# EAGLE design Grove - Voltage Divider v1.0 (EAGLE 6.3)
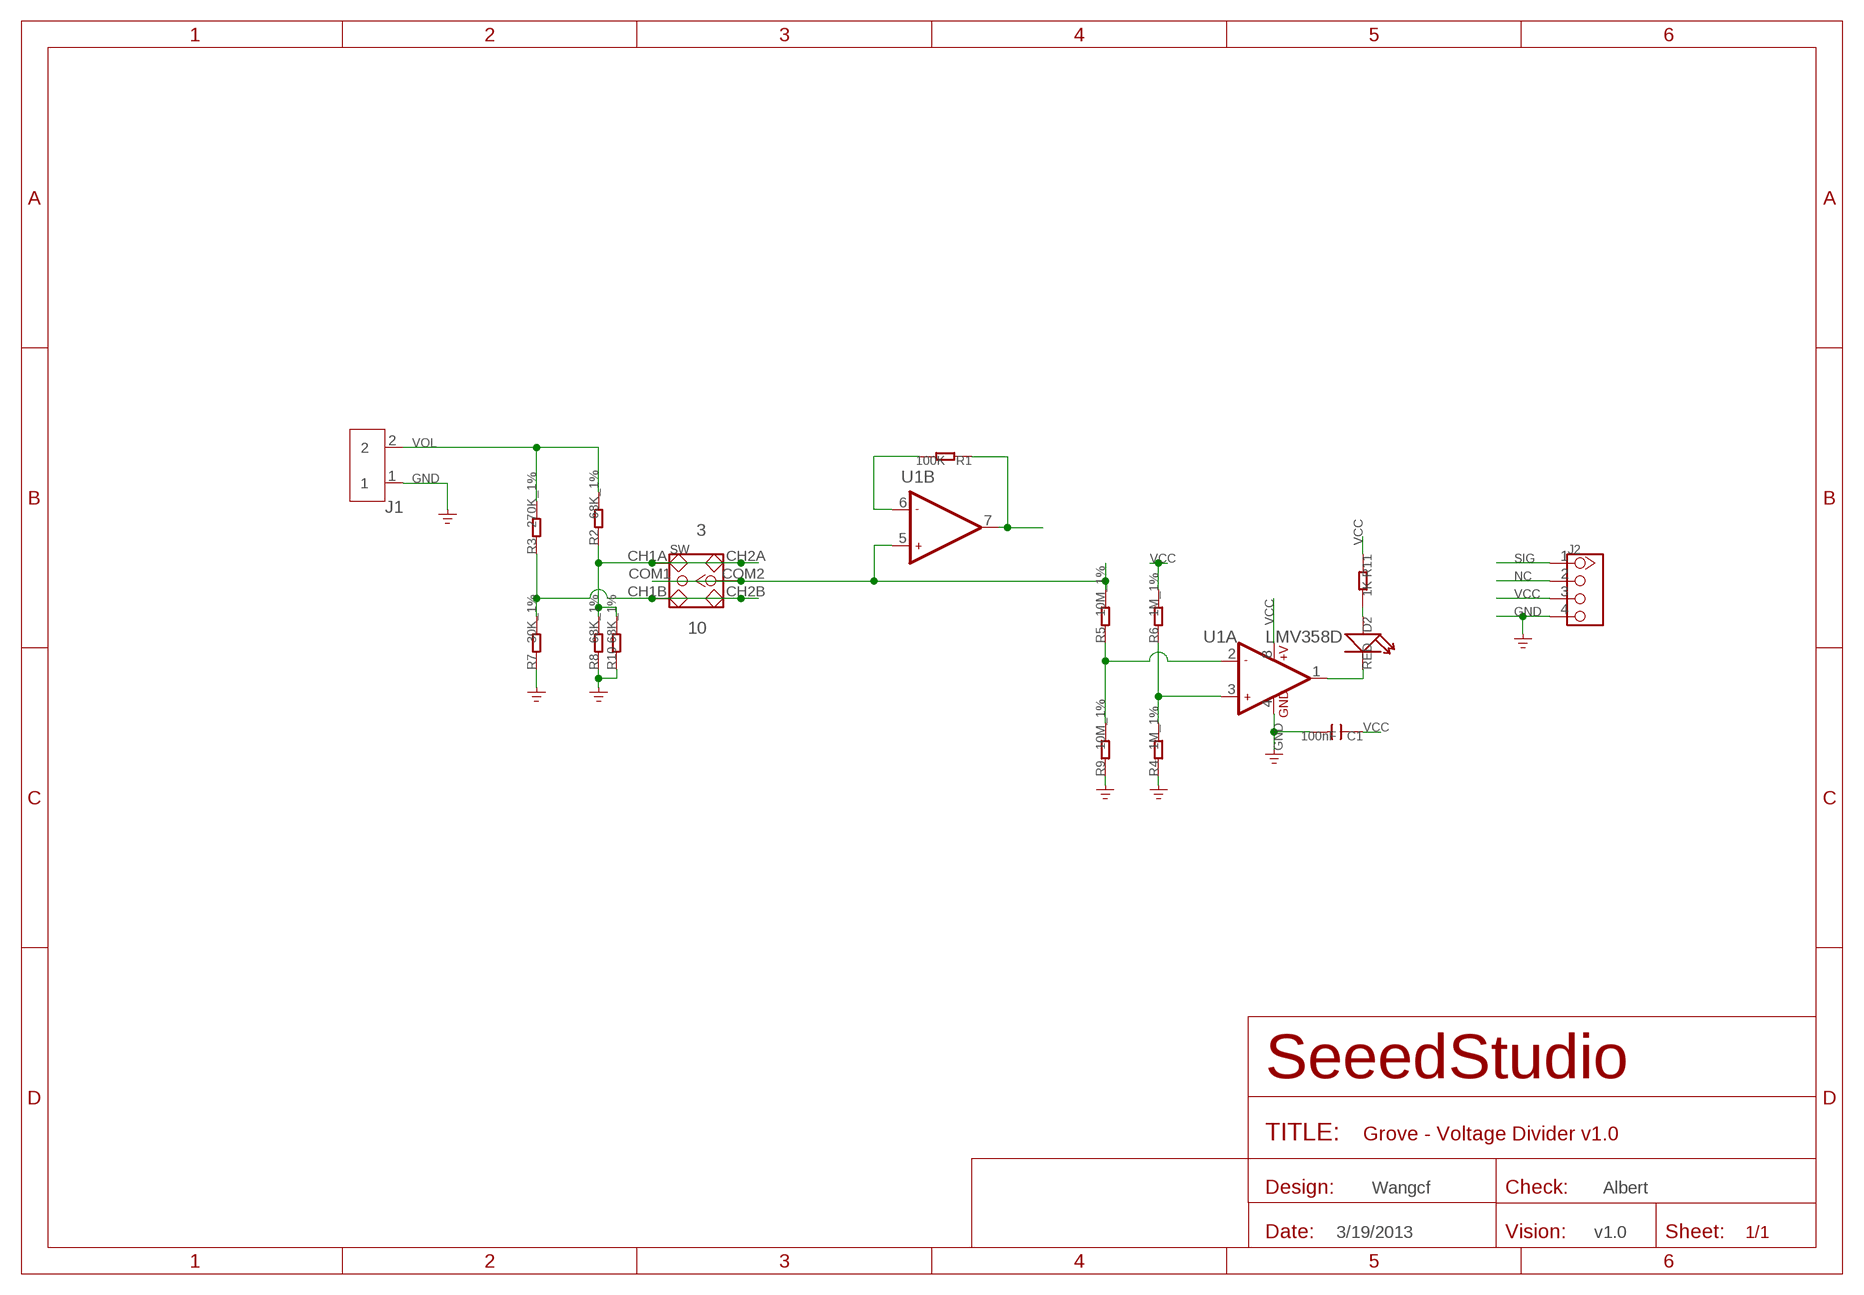
[diagram p0: schematic, sheet 1]

## Parts
C1  100nF  C-0603  [C0603]
D2  RED  LED'0603'  [LED-0603]
J1  SCREW-TERMINAL-2P'5.08'  [2P-5.08]
J2  TWIG-4P-2.0-2.0  [4P-2.0]
R1  100K  R-0603  [R0603]
R2  68K_1%  R-0603  [R0603]
R3  270K_1%  R-0603  [R0603]
R4  1M_1%  R-0603  [R0603]
R5  10M_1%  R-0603  [R0603]
R6  1M_1%  R-0603  [R0603]
R7  30K_1%  R-0603  [R0603]
R8  68K_1%  R-0603  [R0603]
R9  10M_1%  R-0603  [R0603]
R10  68K_1%  R-0603  [R0603]
R11  1K  R-0603  [R0603]
SW  SWITCH-2CH-6P'MS-22D18'  [6P-2CH-2.5-9.1X3.5X3.2H]
U1  LMV358D  [SO08]

## Nets
GND: C1.2 J1.1 J2.4 R4.1 R7.1 R8.1 R9.1 R10.1 U1.4(A:GND)
N$1: D2.+ R11.2
N$2: D2.- U1.1(A:OUT1)
N$5: R5.1 R9.2 U1.2(A:-IN1)
N$6: R5.2 SW.COM1 SW.COM2 U1.5(B:+IN2)
N$7: R4.2 R6.1 U1.3(A:+IN1)
N$8: R1.2 U1.6(B:-IN2)
NC: J2.2
SIG: J2.1 R1.1 U1.7(B:OUT2)
VCC: C1.1 J2.3 R6.2 R11.1 U1.8(A:+V)
VOL: J1.2 R2.2 R3.2
VOL1: R3.1 R7.2 SW.CH1B SW.CH2B
VOL2: R2.1 R8.2 R10.2 SW.CH1A SW.CH2A

## Notes on the sheet
- 3
- 10
- Wangcf | Albert
- 3/19/2013 | v1.0

## Library data of the parts
C1 = Discrete:C*: Ceramic Capacitors
D2 = Discrete:LED*
J1 = Connector:SCREW-TERMINAL-2P
J2 = Connector:TWIG-4P-2.0
R1-R11 = Discrete:R*
SW = Discrete:SWITCH-2CH-6P
U1 = IC:LMV358: General purpose LOW Voltage, Rail-to-Rail Output Amplifiers http://www.fairchildsemi.com/ds/LM/LMV358.pdf

## Net classes
0 default: width 0.203 mm, drill 0.305 mm, clearance 0.152 mm

## Board
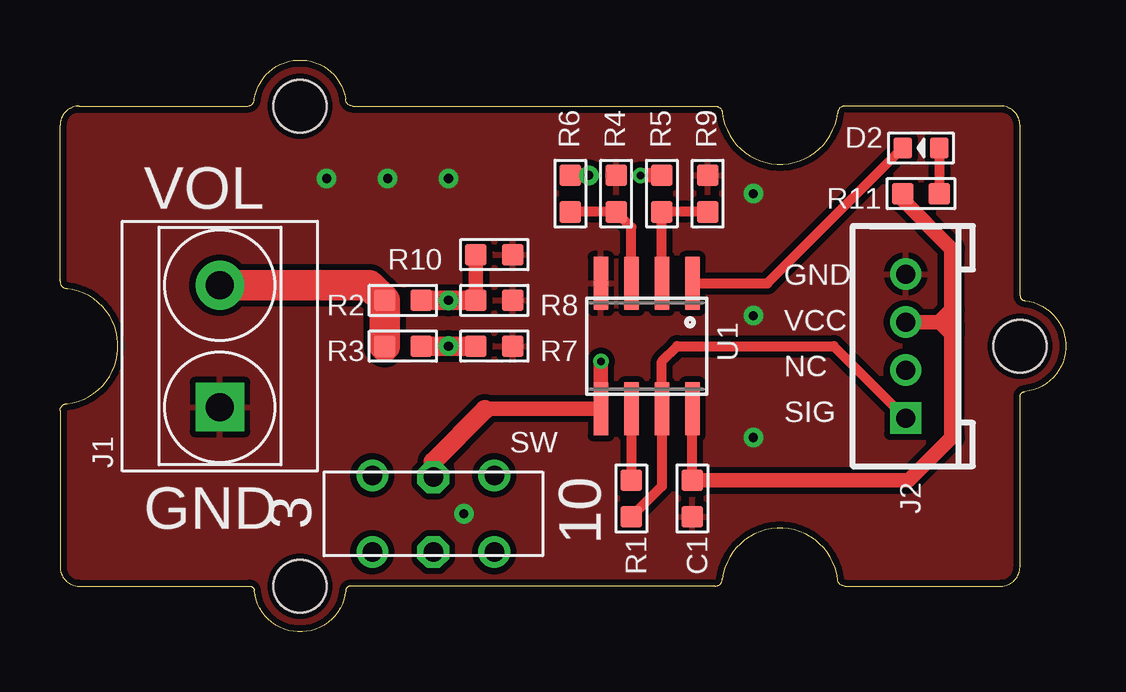
[diagram p1: board, top side]
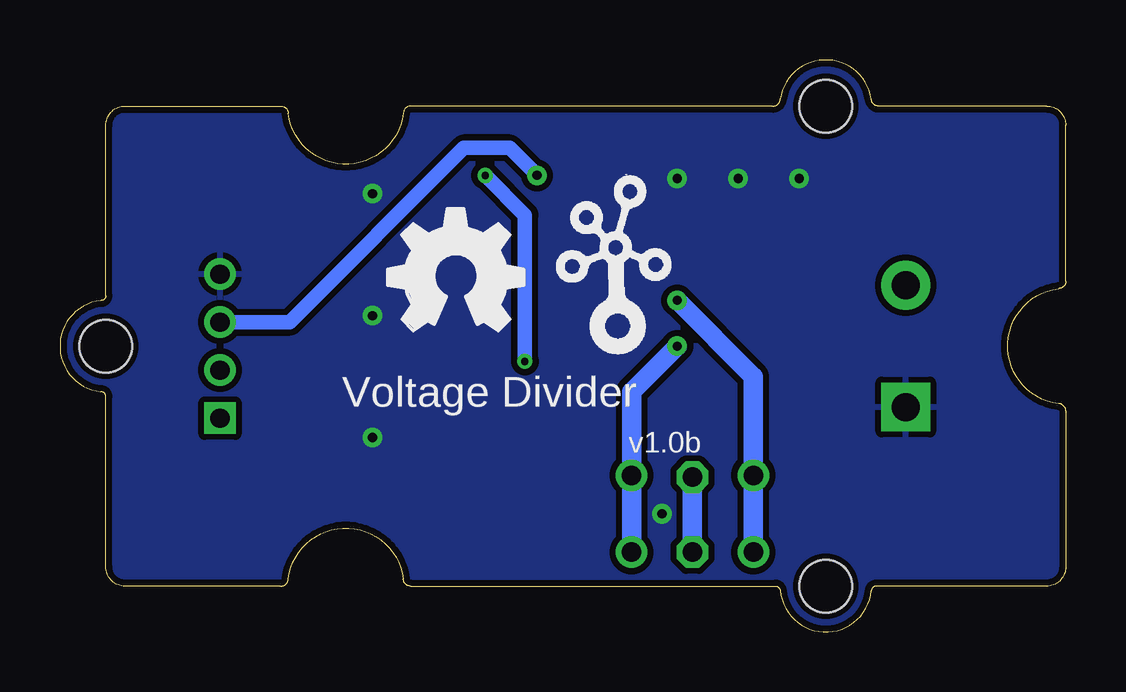
[diagram p2: board, bottom side, seen from below]

Size 41.91 x 23.83 mm. Coordinates in mm from the lower left corner, seen from the top.
Copper layers (1*16): Top 0.035mm / dielectric 1.5mm / Bottom 0.035mm
Design rules "SeeedStudio_rule_no_angle_090911 *": minimum track width 6mil, minimum drill 12mil, track to track 6mil, track to pad 6mil, pad to pad 6mil, via to via 6mil, smd to smd 0mil, copper to edge 10mil, drill to drill 10mil, minimum pad ring 10mil, minimum via ring 6mil, stop-mask expansion 2mil, vias tented up to drill 25mil, thermal gap 10mil

### Footprints (pad centres in the part's own frame; a part is rotated, then mirrored left to right if it is on the bottom)
C0603 = smd 0.889 x 0.889: 1 -0.762,0; 2 0.762,0
LED-0603 = smd 0.762 x 0.889: + -0.762,0; - 0.762,0
2P-5.08 = drill 1.168 pad 2.032 square: 1 0,2.54 | drill 1.168 pad 2.032: 2 0,-2.54
4P-2.0 = drill 0.8 pad 1.27 square: 1 -3,0 | drill 0.8 pad 1.27: 2 -1,0; 3 1,0; 4 3,0
R0603 = smd 0.889 x 0.889: 1 -0.762,0; 2 0.762,0
6P-2CH-2.5-9.1X3.5X3.2H = drill 0.813 pad 1.27: CH1A -2.54,-1.6; CH1B 2.54,-1.6; CH2A -2.54,1.6; CH2B 2.54,1.6 | drill 0.813 pad 1.27 octagon: COM1 0,-1.6; COM2 0,1.524
SO08 = smd 0.61 x 2.21: 1 -1.905,-2.616; 2 -0.635,-2.616; 3 0.635,-2.616; 4 1.905,-2.616; 5 1.905,2.616; 6 0.635,2.616; 7 -0.635,2.616; 8 -1.905,2.616
2U-DIM-W/DRILL = hole 2.2: -10,-10; -10,10; 20,0

### Placement (x,y rotation side)
C1  26.35,5.56 270 top
D2  35.88,20.16 180 top
J1  6.66,11.91 180 top
J2  35.24,11.91 90 top
R1  23.81,5.56 90 top
R2  14.29,13.81 180 top
R3  14.29,11.91 180 top
R4  23.18,18.26 270 top
R5  25.08,18.26 90 top
R6  21.27,18.26 90 top
R7  18.09,11.91 180 top
R8  18.09,13.81 180 top
R9  26.98,18.26 270 top
R10  18.09,15.72 180 top
R11  35.88,18.26 0 top
SW  15.55,4.92 0 top
U1  24.45,11.91 180 top
U$6  [2U-DIM-W/DRILL]  20,11.91 0 top
U$7  [OSHW_FILLX200_NOTEXT]  28.26,12.54 0 bottom
U$8  [TWIGLOGO]  18.73,12.54 0 bottom

### Tracks (layer width: path | path; a pad name or v marks a point on that pad's centre or on a via)
GND  (via drill 0.38 pad 0.81)
  other vias: 28.89,8.1 28.89,18.26 28.89,13.18 16.19,18.89 11.11,18.89 13.65,18.89 16.82,4.92
  pour Top (isolate 0.254): 42.23,23.97 -0.32,23.97 -0.32,-0.16 42.23,-0.16
  pour Bottom (isolate 0.254): 42.23,23.97 -0.32,23.97 -0.32,-0.16 42.23,-0.16
N$1
  Top 0.406: D2.+ R11.2
N$2
  Top 0.406: U1.1 29.47,14.52 D2.-
N$5
  Top 0.406: R9.2 R5.1 U1.2
N$6  (via drill 0.3 pad 0.64)
  Top 0.61: 17.71,9.25 17.75,9.29 U1.5 v22.54,11.27 | v24.19,19.02 R5.2
  Top 0.813: SW.COM2 15.55,7.1 17.71,9.25
  Bottom 0.61: v22.54,11.27 22.54,17.37 v24.19,19.02
  Bottom 0.813: SW.COM1 SW.COM2
N$7
  Top 0.406: U1.3 23.81,16.86 R4.2 R6.1
N$8
  Top 0.406: U1.6 R1.2
SIG
  Top 0.406: R1.1 25.08,6.07 U1.7 25.08,11.27 25.71,11.91 32.24,11.91 J2.1
VCC  (via drill 0.38 pad 0.81)
  Top 0.406: C1.1 U1.8
  Top 0.61: C1.1 35.37,6.32 37.14,8.1 37.14,12.42 | 37.14,12.8 37.14,13.43 | 37.14,13.43 37.14,15.97 35.11,18 R11.1 | J2.3 36.62,12.91 | 36.65,12.91 37.03,12.91 37.14,12.8 | R6.2 v22.03,19.02 | 36.62,12.91 37.14,13.43 | 36.62,12.91 36.65,12.91 | 36.65,12.91 37.14,12.42 | 37.14,12.42 37.14,12.8
  Bottom 0.61: v22.03,19.02 23.18,20.16 25.08,20.16 32.34,12.91 J2.3
VOL
  Top 1.27: R3.2 R2.2 12.89,14.45 J1.2
VOL1  (via drill 0.38 pad 0.81)
  Top 0.813: R7.2 v16.19,11.91 R3.1
  Bottom 0.813: SW.CH1B SW.CH2B 18.09,10 v16.19,11.91
VOL2  (via drill 0.38 pad 0.81)
  Top 0.61: R10.2 17.33,13.94 17.21,13.81
  Top 0.813: R2.1 v16.19,13.81 17.21,13.81 R8.2
  Bottom 0.813: SW.CH1A SW.CH2A 13.02,10.64 v16.19,13.81

### Text on the board
tPlace: VOL | GND | VCC | NC | SIG | GND | 3 | 10
bPlace: Voltage Divider | v1.0b